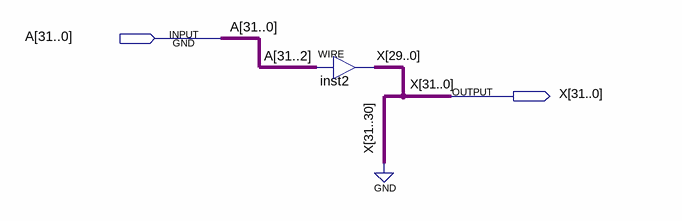
[diagram p0: schematic sheet]
// Quartus schematic shft2r32.bdf as structural Verilog: 1 symbols, 2 pins
module shft2r32 (
  input  [31:0] A,
  output [31:0] X
);

  assign X[29:0] = A[31:2];  // WIRE inst2

  assign X[31:30] = 2'b00;
endmodule
